# Altium schematic sheet 20200902shidu.SchDoc
size A2; SheetNumber: 0; SheetTotal: 0
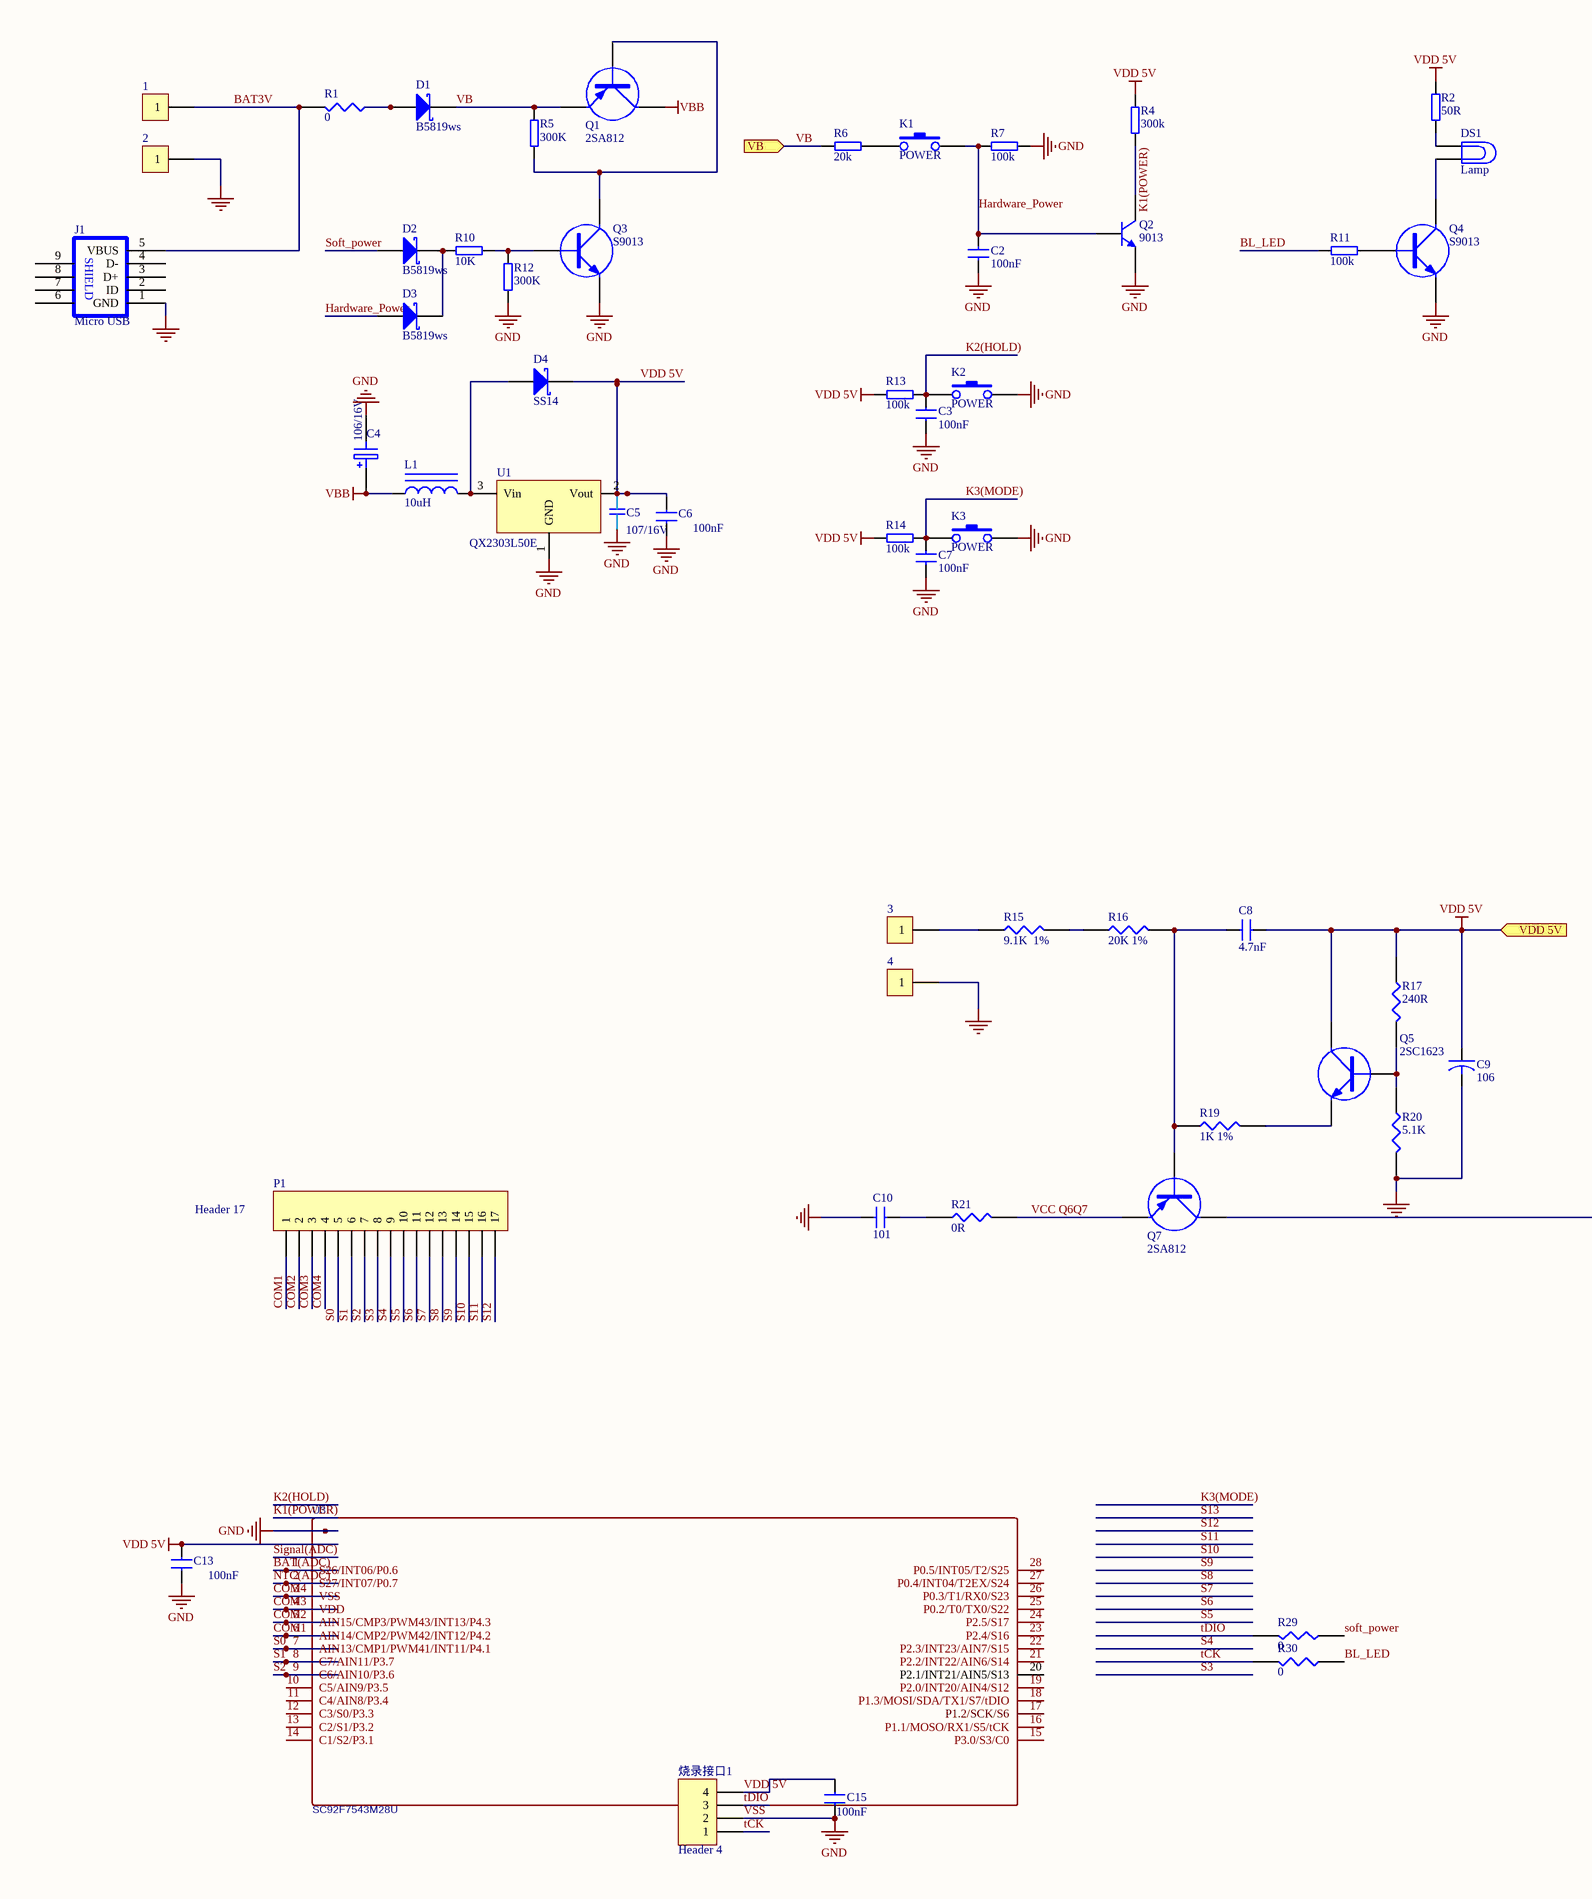
[diagram p0: 20200902shidu.SchDoc, left]
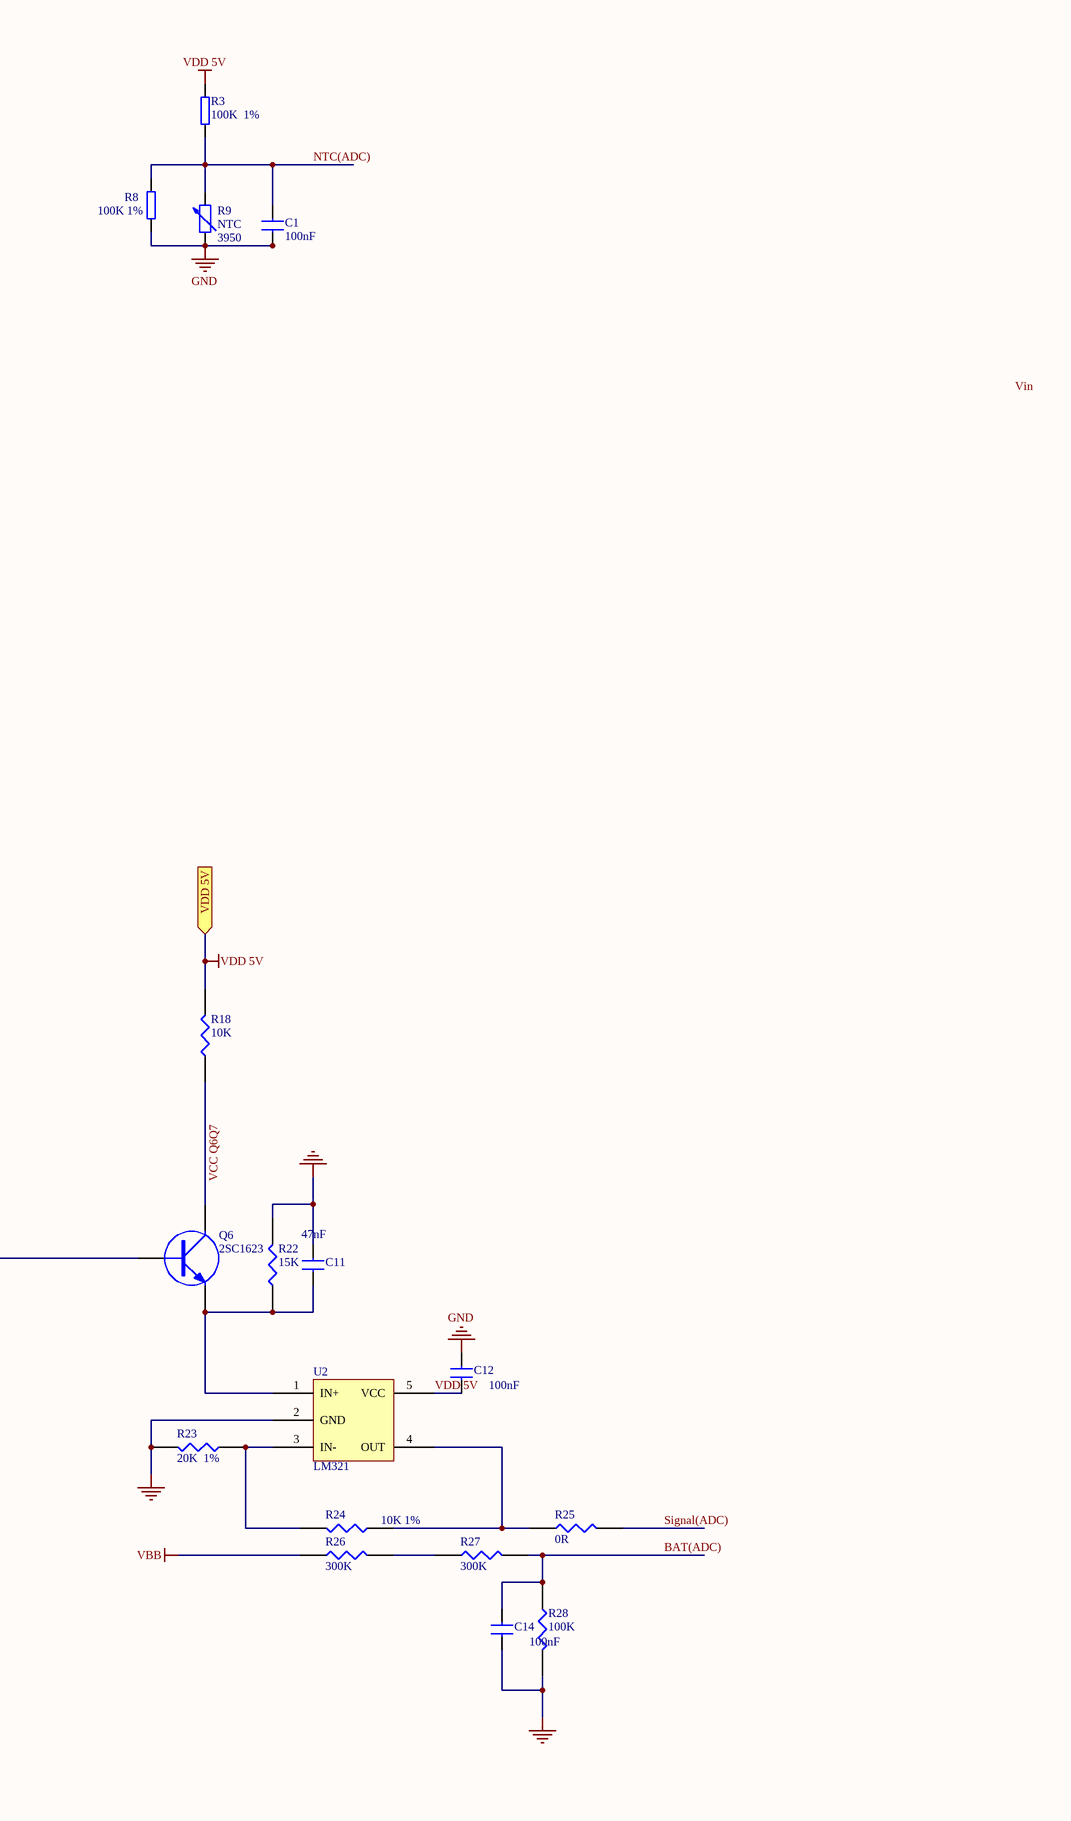
[diagram p1: 20200902shidu.SchDoc, right]

## Parts
1  (no value)  [PADD]
2  (no value)  [PADD]
3  (no value)  [PADD]
4  (no value)  [PADD]
C1  100nF  [c0603]
C2  100nF  [c0603]
C3  100nF  [c0603]
C4  106/16V  [1206C-T]
C5  107/16V  [3528B]
C6  100nF  [c0603]
C7  100nF  [c0603]
C8  4.7nF  [c0603]
C9  106  [1206C]
C10  101  [c0603]
C11  47nF  [c0603]
C12  100nF  [c0603]
C13  100nF  [c0603]
C14  100nF  [c0603]
C15  100nF  [c0603]
D1  B5819ws  [SOD-323_B5819WS]
D2  B5819ws  [SOD-323_B5819WS]
D3  B5819ws  [SOD-323_B5819WS]
D4  SS14  [SOD-323_B5819WS]
DS1  Lamp  [PIN2]
J1  Micro USB  [Micro_USB]
K1  POWER  [AN4*4-SMD]
K2  POWER  [AN4*4-SMD]
K3  POWER  [AN4*4-SMD]
L1  10uH  [CD32 - duplicate]
P1  Header 17  [24p-2.0]
Q1  2SA812  [SOT-23]
Q2  9013  [SOT-23_S9013_J3_NPN]
Q3  S9013  [SOT-23_S9013_J3_NPN]
Q4  S9013  [SOT-23_S9013_J3_NPN]
Q5  2SC1623  [SOT-23]
Q6  2SC1623  [SOT-23]
Q7  2SA812  [SOT-23]
R1  0  [0603R]
R2  50R  [0603R]
R3  100K  1%  [0603R]
R4  300k  [0603R]
R5  300K  [0603R]
R6  20k  [0603R]
R7  100k  [0603R]
R8  100K 1%  [0603R]
R9  NTC  value 3950  [PIN2]
R10  10K  [0603R]
R11  100k  [0603R]
R12  300K  [0603R]
R13  100k  [0603R]
R14  100k  [0603R]
R15  9.1K  1%  [0603R]
R16  20K 1%  [0603R]
R17  240R  [0603R]
R18  10K  [0603R]
R19  1K 1%  [0603R]
R20  5.1K  [0603R]
R21  0R  [0603R]
R22  15K  [0603R]
R23  20K  1%  [0603R]
R24  10K 1%  [0603R]
R25  0R  [0603R]
R26  300K  [0603R]
R27  300K  [0603R]
R28  100K  [0603R]
R29  0  [0603R]
R30  0  [0603R]
U1  QX2303L50E  [SOT-89]
U2  LM321  [SOT-25_]
U3  SC92F7543M28U  [SOP-28]
烧录接口1  Header 4  [HDR1X4]

## Ports
VB (in), VDD 5V

## Nets
VBB: C4.1 L1.1 Q1.3(C) R26.2
VDD 5V: C5.1 C6.1 C8.2 C9.1 C12.2 C13.1 C15.1 D4.2(K) Q5.3(C) R2.1 R3.1 R4.1 R13.1 R14.1 R17.2 R18.2 U1.2(Vout) U2.5(VCC) 烧录接口1.4 ; port VDD 5V
VSS: 2.1 4.1 C1.2 C2.2 C3.2 C4.2 C5.2 C6.2 C7.2 C9.2 C10.1 C11.1 C12.1 C13.2 C14.2 C15.2 J1.1(GND) K2.2 K3.2 Q2.1(E) Q3.E Q4.E R7.1 R8.2 R9.1 R12.1 R20.1 R22.2 R23.2 R28.1 U1.1(GND) U2.2(GND) 烧录接口1.2  [also labelled GND]
BAT3V: 1.1 J1.5(VBUS) R1.2
BAT(ADC): C14.1 R27.1 R28.2 U3.1(S26/INT06/P0.6)
BL_LED: R11.2 R30.1
COM1: P1.1 U3.6(AIN14/CMP2/PWM42/INT12/P4.2)
COM2: P1.2 U3.5(AIN15/CMP3/PWM43/INT13/P4.3)
COM3: P1.3 U3.4(VDD)
COM4: P1.4 U3.3(VSS)
Hardware_Power: C2.1 D3.1(A) K1.2 Q2.2(B) R7.2
K1(POWER): Q2.3(C) R4.2
K2(HOLD): C3.1 K2.1 R13.2
K3(MODE): C7.1 K3.1 R14.2
NTC(ADC): C1.1 R3.2 R8.1 R9.2 U3.2(S27/INT07/P0.7)
S0: P1.5 U3.7(AIN13/CMP1/PWM41/INT11/P4.1)
S1: P1.6 U3.8(C7/AIN11/P3.7)
S2: P1.7 U3.9(C6/AIN10/P3.6)
S3: P1.8
S4: P1.9
S5: P1.10
S6: P1.11
S7: P1.12
S8: P1.13
S9: P1.14
S10: P1.15
S11: P1.16
S12: P1.17
Signal(ADC): R25.1
Soft_power: D2.1(A) R29.1
tCK: R30.2 烧录接口1.1
tDIO: R29.2 烧录接口1.3
VB: D1.2(K) Q1.2(E) R5.2 R6.2 ; port VB
VCC Q6Q7: Q6.3(C) Q7.2(E) R18.1 R21.1
Net3_1: 3.1 R15.2
NetC8_1: C8.1 Q7.1(B) R16.1 R19.2
NetC10_2: C10.2 R21.2
NetC11_2: C11.2 Q6.2(E) R22.1 U2.1(IN+)
NetD1_1: D1.1(A) R1.1
NetD2_2: D2.2(K) D3.2(K) R10.2
NetD4_1: D4.1(A) L1.2 U1.3(Vin)
NetDS1_1: DS1.1 R2.2
NetDS1_2: DS1.2 Q4.C
NetK1_1: K1.1 R6.1
NetQ1_1: Q1.1(B) Q3.C R5.1
NetQ3_B: Q3.B R10.1 R12.2
NetQ4_B: Q4.B R11.1
NetQ5_1: Q5.1(B) R17.1 R20.2
NetQ5_2: Q5.2(E) R19.1
NetQ6_1: Q6.1(B) Q7.3(C)
NetR15_1: R15.1 R16.2
NetR23_1: R23.1 R24.2 U2.3(IN-)
NetR24_1: R24.1 R25.2 U2.4(OUT)
NetR26_1: R26.1 R27.2

Not connected (* = marked no-connect by the designer): J1 2(ID) 3(D+) 4(D-) 6 7 8 9; U3 10(C5/AIN9/P3.5) 11(C4/AIN8/P3.4) 12(C3/S0/P3.3) 13(C2/S1/P3.2) 14(C1/S2/P3.1) 15(P3.0/S3/C0) 16(P1.1/MOSO/RX1/S5/tCK) 17(P1.2/SCK/S6) 18(P1.3/MOSI/SDA/TX1/S7/tDIO) 19(P2.0/INT20/AIN4/S12) 20(P2.1/INT21/AIN5/S13) 21(P2.2/INT22/AIN6/S14) 22(P2.3/INT23/AIN7/S15) 23(P2.4/S16) 24(P2.5/S17) 25(P0.2/T0/TX0/S22) 26(P0.3/T1/RX0/S23) 27(P0.4/INT04/T2EX/S24) 28(P0.5/INT05/T2/S25)

## Notes on the sheet
- Labels drawn without touching a wire or pin: Vin
- (in symbol USB_AB) SHIELD

## Library data of the parts
1-4 = CON1: Connector
C1-C3 C6 C7 C12-C15 = CAP: Capacitor; Value: 100nF
C4 = ELECTRO1: Electrolytic Capacitor
C5 = CAP-TYPE1: 交货信息: 交期&交地&报价&税率; 元器件规格: 精度&温漂特性&额定电压&ESL&ESR; 供应商信息: 名称&联系方式; 品牌与型号: *; 元器件类型: *
C8 C10 C11 = CAP: Capacitor; Value: 100nF
C9 = CAPACITOR
D1-D4 = Diode 11DQ03: Schottky Rectifier; Published: 8-Jun-2000; LatestRevisionDate: 17-Jul-2002; LatestRevisionNote: Re-released for DXP Platform.; DatasheetVersion: Dec-1997; PackageReference: DO-204AL; Publisher: Altium Limited; Code_JEDEC: DO-204-AL; ComponentLink1Description: Manufacturer Link; ComponentLink1URL: http://www.irf.com/; ComponentLink2Description: Datasheet; ComponentLink2URL: http://www.irf.com/product-info/datasheets/data/11dq03.pdf
DS1 = Lamp: Incandescent Bulb; Published: 24-Mar-1999; LatestRevisionDate: 17-Jul-2002; LatestRevisionNote: Re-released for DXP Platform.; PackageReference: PIN2; Publisher: Altium Limited
J1 = USB_AB
K1-K3 = SW-PB
L1 = Inductor Iron: Magnetic-Core Inductor
P1 = Header 17: Header, 17-Pin; LatestRevisionDate: 17-Jul-2002; LatestRevisionNote: Re-released for DXP Platform.; Publisher: Altium Limited
Q1 Q7 = PNP: PNP Transistor
Q2 = 2N3904: NPN General Purpose Amplifier; pin to pad: 1>E 2>B 3>C; Published: 8-Jun-2000; LatestRevisionDate: 15-Jan-2003; LatestRevisionNote: PCB Footprint 'BCY-W3/D4.7' replaced; DatasheetVersion: 1997; PackageVersion: Sep-1998; PackageReference: TO-92A; Publisher: Altium Limited; Code_JEDEC: TO-92A; ComponentLink1Description: Manufacturer Link; ComponentLink1URL: http://www.fairchildsemi.com/; ComponentLink2Description: Datasheet; ComponentLink2URL: http://www.fairchildsemi.com/ds/2N%2F2N3904.pdf
Q3-Q6 = NPN: NPN Transistor
R1 R15-R30 = RES1
R2-R8 R10-R14 = RES: Resistor; TC: *
R9 = Res Adj2: Variable Resistor; Set Position: 0.5; Published: 8-Jun-2000; LatestRevisionDate: 17-Jul-2002; LatestRevisionNote: Re-released for DXP Platform.; PackageReference: AXIAL-0.6; Publisher: Altium Limited; PackageDescription: Axial Device, Thru-Hole; 2 Leads; 0.6 in Pin Spacing
U1 = MCC6288
U2 = LVM321
U3 = SC92F7547: BOM_Manufacturer: sinowealth; BOM_Manufacturer Part: SH88F48; Contributor: 258058A; SMT Type: Extend; BOM_Supplier Part: SH88F48; BOM_LCSC Assembly: Yes; spicePre: U; spiceSymbolName: SH88F48
烧录接口1 = Header 4: Header, 4-Pin; LatestRevisionDate: 17-Jul-2002; LatestRevisionNote: Re-released for DXP Platform.; Publisher: Altium Limited